# EAGLE design nanoscan (EAGLE 9.6.2)
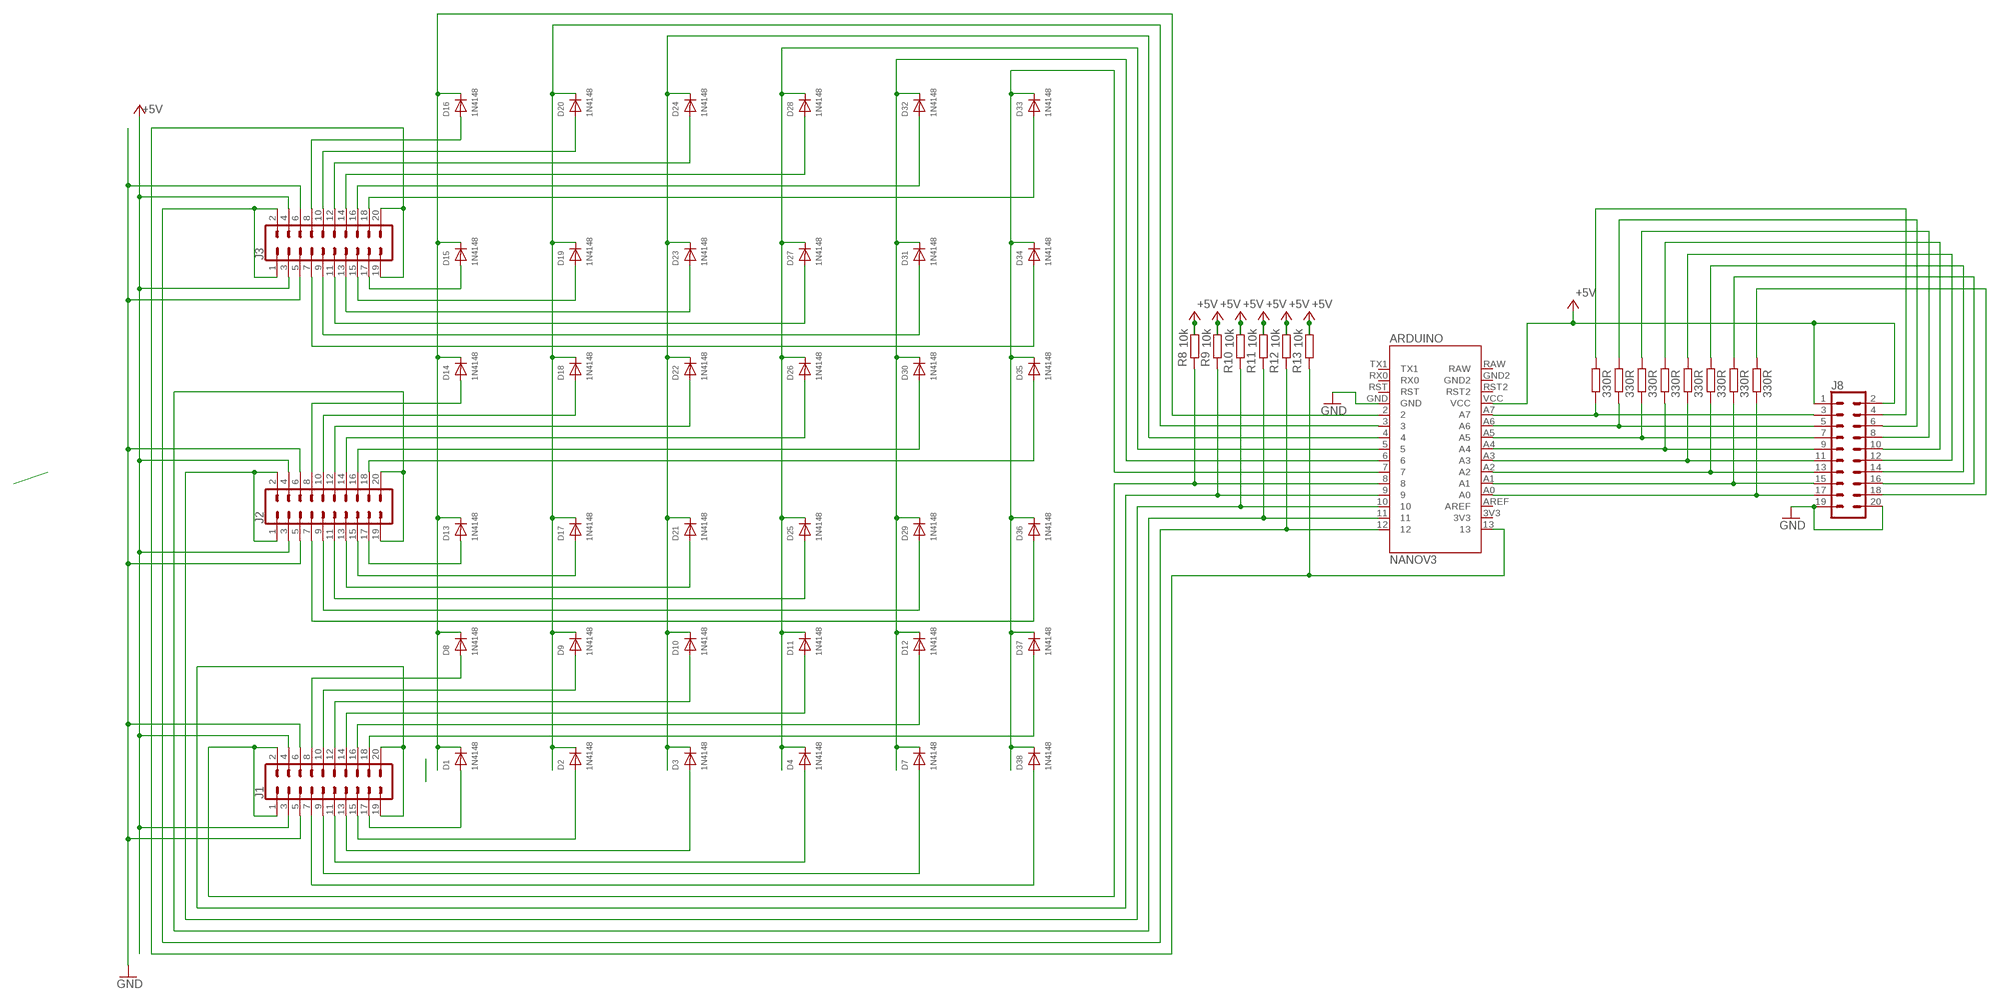
[diagram p0: schematic, sheet 1]

## Parts
ARDUINO  NANOV3  [NANOV3]
D1  1N4148  DIODEDO-1N4148  [DO-1N4148]
D2  1N4148  DIODEDO-1N4148  [DO-1N4148]
D3  1N4148  DIODEDO-1N4148  [DO-1N4148]
D4  1N4148  DIODEDO-1N4148  [DO-1N4148]
D7  1N4148  DIODEDO-1N4148  [DO-1N4148]
D8  1N4148  DIODEDO-1N4148  [DO-1N4148]
D9  1N4148  DIODEDO-1N4148  [DO-1N4148]
D10  1N4148  DIODEDO-1N4148  [DO-1N4148]
D11  1N4148  DIODEDO-1N4148  [DO-1N4148]
D12  1N4148  DIODEDO-1N4148  [DO-1N4148]
D13  1N4148  DIODEDO-1N4148  [DO-1N4148]
D14  1N4148  DIODEDO-1N4148  [DO-1N4148]
D15  1N4148  DIODEDO-1N4148  [DO-1N4148]
D16  1N4148  DIODEDO-1N4148  [DO-1N4148]
D17  1N4148  DIODEDO-1N4148  [DO-1N4148]
D18  1N4148  DIODEDO-1N4148  [DO-1N4148]
D19  1N4148  DIODEDO-1N4148  [DO-1N4148]
D20  1N4148  DIODEDO-1N4148  [DO-1N4148]
D21  1N4148  DIODEDO-1N4148  [DO-1N4148]
D22  1N4148  DIODEDO-1N4148  [DO-1N4148]
D23  1N4148  DIODEDO-1N4148  [DO-1N4148]
D24  1N4148  DIODEDO-1N4148  [DO-1N4148]
D25  1N4148  DIODEDO-1N4148  [DO-1N4148]
D26  1N4148  DIODEDO-1N4148  [DO-1N4148]
D27  1N4148  DIODEDO-1N4148  [DO-1N4148]
D28  1N4148  DIODEDO-1N4148  [DO-1N4148]
D29  1N4148  DIODEDO-1N4148  [DO-1N4148]
D30  1N4148  DIODEDO-1N4148  [DO-1N4148]
D31  1N4148  DIODEDO-1N4148  [DO-1N4148]
D32  1N4148  DIODEDO-1N4148  [DO-1N4148]
D33  1N4148  DIODEDO-1N4148  [DO-1N4148]
D34  1N4148  DIODEDO-1N4148  [DO-1N4148]
D35  1N4148  DIODEDO-1N4148  [DO-1N4148]
D36  1N4148  DIODEDO-1N4148  [DO-1N4148]
D37  1N4148  DIODEDO-1N4148  [DO-1N4148]
D38  1N4148  DIODEDO-1N4148  [DO-1N4148]
J1  CONN_10X2SPECIAL  [2X10_LOCK_SPECIAL]
J2  CONN_10X2SPECIAL  [2X10_LOCK_SPECIAL]
J3  CONN_10X2SPECIAL  [2X10_LOCK_SPECIAL]
J8  CONN_10X2SPECIAL  [2X10_LOCK_SPECIAL]
R0  330R  R-EU_0207/10  [0207/10]
R1  330R  R-EU_0207/10  [0207/10]
R2  330R  R-EU_0207/10  [0207/10]
R3  330R  R-EU_0207/10  [0207/10]
R4  330R  R-EU_0207/10  [0207/10]
R5  330R  R-EU_0207/10  [0207/10]
R6  330R  R-EU_0207/10  [0207/10]
R7  330R  R-EU_0207/10  [0207/10]
R8  10k  R-EU_0207/10  [0207/10]
R9  10k  R-EU_0207/10  [0207/10]
R10  10k  R-EU_0207/10  [0207/10]
R11  10k  R-EU_0207/10  [0207/10]
R12  10k  R-EU_0207/10  [0207/10]
R13  10k  R-EU_0207/10  [0207/10]

## Nets
+5V [PWR]: ARDUINO.VCC J1.3 J1.4 J2.3 J2.4 J3.3 J3.4 J8.1 J8.2 R8.1 R9.1 R10.1 R11.1 R12.1 R13.1
GND [GND]: ARDUINO.GND J1.5 J1.6 J2.5 J2.6 J3.5 J3.6 J8.19 J8.20
N$2: ARDUINO.6 D7.C D12.C D29.C D30.C D31.C D32.C
N$3: ARDUINO.2 D1.C D8.C D13.C D14.C D15.C D16.C
N$5: ARDUINO.5 D4.C D11.C D25.C D26.C D27.C D28.C
N$7: D33.A J3.18
N$8: D32.A J3.16
N$9: D28.A J3.14
N$10: D24.A J3.12
N$11: D20.A J3.10
N$12: D16.A J3.8
N$13: D34.A J3.7
N$14: D31.A J3.9
N$15: D27.A J3.11
N$16: D23.A J3.13
N$17: D19.A J3.15
N$18: D15.A J3.17
N$19: D35.A J2.18
N$20: D30.A J2.16
N$21: D26.A J2.14
N$22: D22.A J2.12
N$23: D18.A J2.10
N$24: D14.A J2.8
N$25: D38.A J1.7
N$26: D7.A J1.9
N$27: D4.A J1.11
N$28: D3.A J1.13
N$29: D2.A J1.15
N$30: D1.A J1.17
N$31: D37.A J1.18
N$32: D12.A J1.16
N$33: D11.A J1.14
N$34: D10.A J1.12
N$35: D9.A J1.10
N$36: D8.A J1.8
N$37: D36.A J2.7
N$38: D29.A J2.9
N$39: D25.A J2.11
N$40: D21.A J2.13
N$41: D17.A J2.15
N$42: D13.A J2.17
N$43: ARDUINO.9 J1.19 J1.20 R9.2
N$44: ARDUINO.12 J3.1 J3.2 R12.2
N$45: ARDUINO.13 J3.19 J3.20 R13.2
N$46: ARDUINO.10 J2.1 J2.2 R10.2
N$47: ARDUINO.8 J1.1 J1.2 R8.2
N$48: ARDUINO.11 J2.19 J2.20 R11.2
N$49: ARDUINO.A7 J8.3 R7.1
N$50: ARDUINO.A6 J8.5 R6.1
N$51: ARDUINO.A5 J8.7 R5.1
N$52: ARDUINO.A4 J8.9 R4.1
N$53: ARDUINO.A3 J8.11 R3.1
N$54: ARDUINO.A2 J8.13 R2.1
N$55: ARDUINO.A1 J8.15 R1.1
N$56: ARDUINO.A0 J8.17 R0.1
N$57: J8.18 R0.2
N$58: J8.16 R1.2
N$59: J8.14 R2.2
N$60: J8.12 R3.2
N$61: J8.10 R4.2
N$62: J8.8 R5.2
N$63: J8.6 R6.2
N$64: J8.4 R7.2
N$65: ARDUINO.3 D2.C D9.C D17.C D18.C D19.C D20.C
N$67: ARDUINO.4 D3.C D10.C D21.C D22.C D23.C D24.C
N$70: ARDUINO.7 D33.C D34.C D35.C D36.C D37.C D38.C
Unconnected: ARDUINO.3V3 ARDUINO.AREF ARDUINO.GND2 ARDUINO.RAW ARDUINO.RST ARDUINO.RST2 ARDUINO.RX0 ARDUINO.TX1

## Library data of the parts
ARDUINO = Arduino Nano by Jazz:NANOV3
D1-D4 D7-D38 = adafruit:DIODE: Diode SMADIODE - SMA Surface Mount Package 20V 1A Schottky Diode Digikey: 641-1014-6-ND DO-1N4148 - Through Hole Small Current Diode SOD-123 20V 1 A (.5mV Vf) Schottky Diode - Digikey: MBRX120TPMSCT-ND SOD-323 10V 570mA (.38mV Vf, 3ns) Schottky Diode - Digikey: ZLLS410CT-ND SOD-523 30V 30mA Schottky Diode (RB751S-40TE61) - Digikey: RB751S-40TE61CT-ND SOT23-R/W - SOT23 Package (R = Solder Paste/Reflow Ovens, W = Hand-Soldering) BAT54Film 40V 300mA - Digikey: 497-7162-1-ND
J1-J3 J8 = SparkFun-Connectors:CONN_10X2: Multi connection point. Often used as Generic Header-pin footprint for 0.1 inch spaced/style header connections On any of the 0.1 inch spaced packages, you can populate with these: Break Away Headers - Straight <https://www.sparkfun.com/products/116> (PRT-00116) Break Away Male Headers - Right Angle <https://www.sparkfun.com/products/553> (PRT-00553) Female Headers <https://www.sparkfun.com/products/115> (PRT-00115) Break Away Headers - Machine Pin <https://www.sparkfun.com/products/117> (PRT-00117) Break Away Female Headers - Swiss Machine Pin <https://www.sparkfun.com/products/743> (PRT-00743) Special note about the "SPECIAL" package: This was SPECIALLY designed to be used with our Graphic LCD Backpack. Be sure you want to use this! It is not only staggered on each line of header holes, but IT IS ALSO offset of the center point of the top and bottom lines by 5 mil. This causes the headers to lock into place on the "standard" footprint on the LCD screen. The extra squares on the tdocu layer are there simply to reference other pins (if you were to actually populate a longer header than ten long - this is what we do with the backpacks).
R0 R1-R13 = resistor:R-EU_: RESISTOR, European symbol

## Net classes
0 default: width 0.508 mm, drill 0.254 mm, clearance 0.254 mm
1 GND: width 1.016 mm, drill 0.508 mm, clearance 0.254 mm to class 0, clearance 0.254 mm
2 PWR: width 1.016 mm, drill 1.016 mm, clearance 0.254 mm to class 0, clearance 0.254 mm to class 1, clearance 0.254 mm

## Board
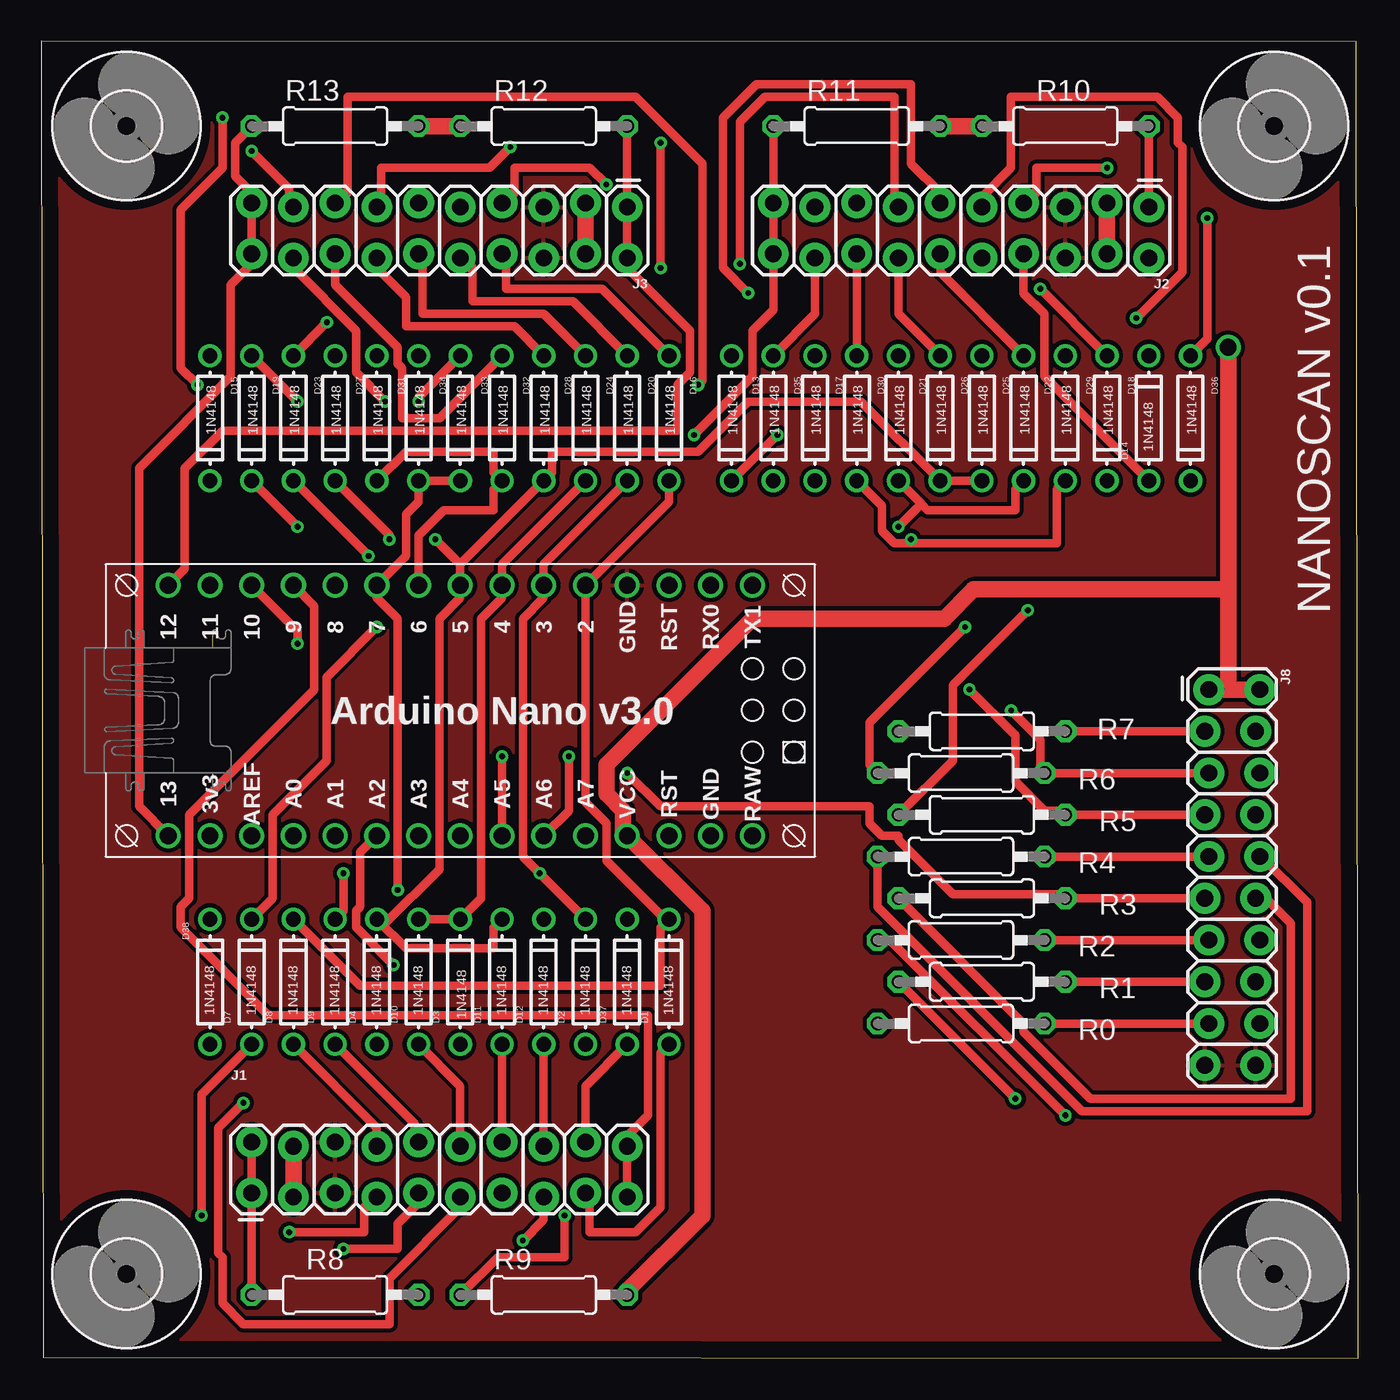
[diagram p1: board, top side]
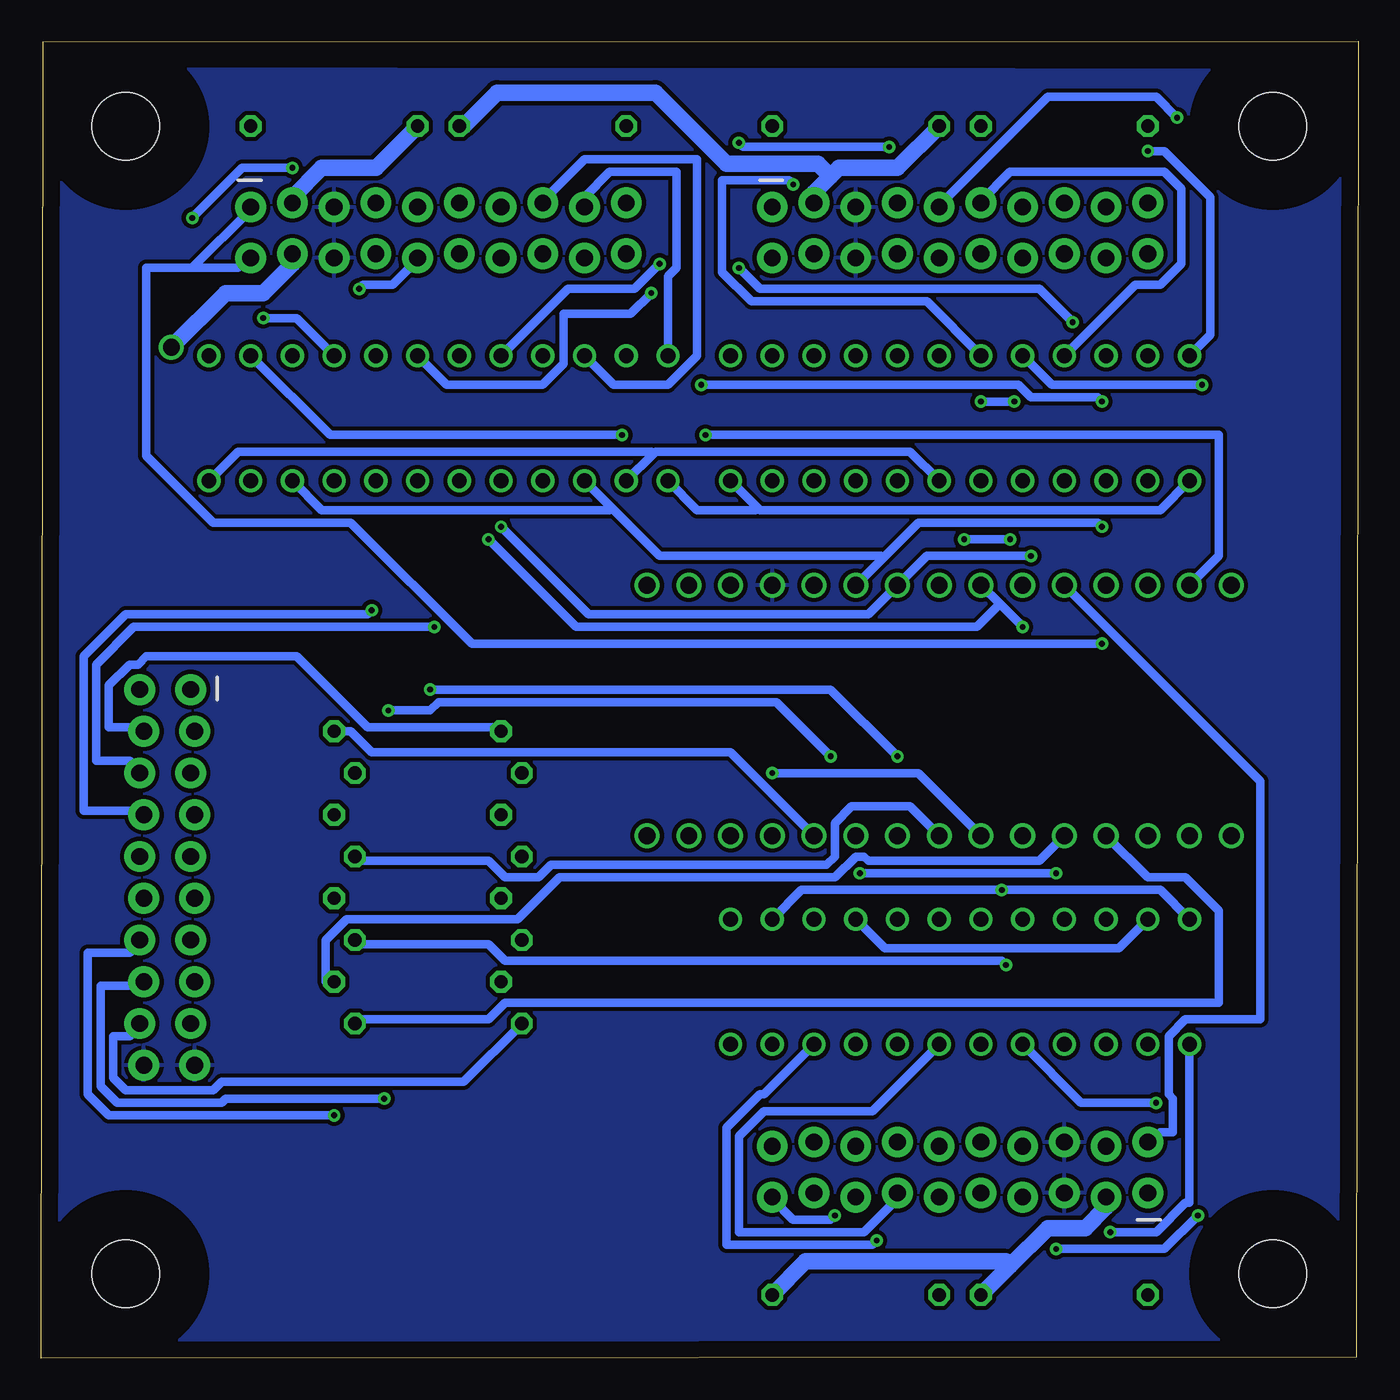
[diagram p2: board, bottom side, seen from below]

Size 80.19 x 80.16 mm. Coordinates in mm from the lower left corner, seen from the top.
Outline: 0.12,0.06 80.19,0 80.07,80.13 0,80.16 0.12,0.06
Copper layers (1+2*15+16): Top 0.035mm / dielectric 1.5mm / Route2 0.035mm / dielectric 0.15mm / Route15 0.035mm / dielectric 0.2mm / Bottom 0.035mm
Design rules "default *": minimum track width 6mil, minimum drill 0.35mm, track to track 6mil, track to pad 6mil, pad to pad 6mil, via to via 6mil, smd to smd 6mil, copper to edge 40mil, drill to drill 6mil, minimum pad ring 10mil, minimum via ring 8mil, stop-mask expansion 4mil, vias tented up to drill 0mil, thermal gap 10mil

### Footprints (pad centres in the part's own frame; a part is rotated, then mirrored left to right if it is on the bottom)
NANOV3 = drill 1.016: 2 -7.62,5.08; 3 -7.62,2.54; 3V3 7.62,-17.78; 4 -7.62,0; 5 -7.62,-2.54; 6 -7.62,-5.08; 7 -7.62,-7.62; 8 -7.62,-10.16; 9 -7.62,-12.7; 10 -7.62,-15.24; 11 -7.62,-17.78; 12 -7.62,-20.32; 13 7.62,-20.32; A0 7.62,-12.7; A1 7.62,-10.16; A2 7.62,-7.62; A3 7.62,-5.08; A4 7.62,-2.54; A5 7.62,0; A6 7.62,2.54; A7 7.62,5.08; AREF 7.62,-15.24; GND -7.62,7.62; GND2 7.62,12.7; RAW 7.62,15.24; RST -7.62,10.16; RST2 7.62,10.16; RX0 -7.62,12.7; TX1 -7.62,15.24; VCC 7.62,7.62
DO-1N4148 = drill 0.9: A -3.81,0; C 3.81,0
2X10_LOCK_SPECIAL = drill 1.016 pad 1.88: 1 0,-0.152; 2 0,2.946; 3 2.54,-0.406; 4 2.54,2.692; 5 5.08,-0.152; 6 5.08,2.946; 7 7.62,-0.406; 8 7.62,2.692; 9 10.16,-0.152; 10 10.16,2.946; 11 12.7,-0.406; 12 12.7,2.692; 13 15.24,-0.152; 14 15.24,2.946; 15 17.78,-0.406; 16 17.78,2.692; 17 20.32,-0.152; 18 20.32,2.946; 19 22.86,-0.406; 20 22.86,2.692
0207/10 = drill 0.813 octagon: 1 -5.08,0; 2 5.08,0
4,1 = hole 4.1: 0,0

### Placement (x,y rotation side)
ARDUINO  28.06,39.43 270 top
D1  38.22,22.92 90 top
D2  33.14,22.92 90 top
D3  25.52,22.92 90 top
D4  20.44,22.92 90 top
D7  12.82,22.92 90 top
D8  15.36,22.92 90 top
D9  17.9,22.92 90 top
D10  22.98,22.92 90 top
D11  28.06,22.92 90 top
D12  30.6,22.92 90 top
D13  42.03,57.21 270 top
D14  67.43,57.21 90 top
D15  10.28,57.21 270 top
D16  38.22,57.21 270 top
D17  47.11,57.21 270 top
D18  64.89,57.21 270 top
D19  12.82,57.21 270 top
D20  35.68,57.21 270 top
D21  52.19,57.21 270 top
D22  59.81,57.21 270 top
D23  15.36,57.21 270 top
D24  33.14,57.21 270 top
D25  57.27,57.21 270 top
D26  54.73,57.21 270 top
D27  17.9,57.21 270 top
D28  30.6,57.21 270 top
D29  62.35,57.21 270 top
D30  49.65,57.21 270 top
D31  20.44,57.21 270 top
D32  28.06,57.21 270 top
D33  25.52,57.21 270 top
D34  22.98,57.21 270 top
D35  44.57,57.21 270 top
D36  69.97,57.21 270 top
D37  35.68,22.92 90 top
D38  10.28,22.92 90 top
J1  12.82,10.22 0 top
J2  67.43,69.91 180 top
J3  35.68,69.91 180 top
J8  71.24,40.7 270 top
R0  56,20.38 180 top
R1  57.27,22.92 180 top
R2  56,25.46 180 top
R3  57.27,28 180 top
R4  56,30.54 180 top
R5  57.27,33.08 180 top
R6  56,35.62 180 top
R7  57.27,38.16 180 top
R8  17.9,3.87 180 top
R9  30.6,3.87 180 top
R10  62.35,74.99 0 top
R11  49.65,74.99 180 top
R12  30.6,74.99 0 top
R13  17.9,74.99 180 top
U$1  [4,1]  75.05,5.14 0 top
U$2  [4,1]  75.05,74.99 0 top
U$3  [4,1]  5.2,74.99 0 top
U$4  [4,1]  5.2,5.14 0 top

### Tracks (layer width: path | path; a pad name or v marks a point on that pad's centre or on a via)
+5V  (via drill 1.02)
  Top 1.016: R9.1 35.68,4.12 40.25,8.7 40.25,27.24 ARDUINO.VCC 35.43,32.06 35.43,33.33 34.41,34.35 34.41,36.13 43.3,45.02 54.98,45.02 56.76,46.8 72.26,46.8 | J1.3 J1.4 | R12.1 R13.1 | J3.3 J3.4 | J8.2 72.26,40.7 | 72.26,40.7 J8.1 | R10.1 R11.1 | J2.3 J2.4 | v72.26,61.53 72.26,46.8 | 72.26,46.8 72.26,40.7
  Bottom 1.016: 21.2,5.65 18.92,7.93 16.63,7.93 15.36,9.2 J1.3 | 21.2,5.65 R8.1 | R9.1 33.65,5.9 21.46,5.9 21.2,5.65 | R12.1 28.06,72.45 31.62,72.45 32.12,71.94 | 32.12,71.94 33.14,70.93 J3.3 | R10.1 59.81,72.45 63.11,72.45 64.89,70.67 J2.3 | v72.26,61.53 68.95,64.83 66.67,64.83 64.89,66.61 J2.4 | 32.12,71.94 32.89,72.7 38.47,72.7 42.79,77.02 52.44,77.02 54.48,74.99 R11.1
GND
  pour Bottom: -16.73,78.42 133.78,78.54 133.78,-39.72 -15.98,-39.72 -16.39,-39.31
  pour Top: -21.47,-13.91 -21.47,90.23 125.85,90.23 125.85,-13.91
N$2  (via drill 0.35)
  Top 0.508: D30.C 51.17,51.88 51.17,50.35 51.94,49.59 52.95,49.59 | 52.95,49.59 61.84,49.59 61.84,52.89 D29.C | D31.C 22.22,55.18 27.55,55.18 27.55,53.91 D32.C 27.81,53.4 27.81,53.15 27.55,52.89 27.55,51.62 24.5,51.62 22.98,50.1 ARDUINO.6 | v20.44,44.51 17.39,41.46 17.39,36.38 14.09,33.08 14.09,28 D7.C | v52.95,49.84 52.95,49.59
  Bottom 0.508: D7.C 14.6,24.95 28.82,24.95 D12.C | v20.44,44.51 21.84,45.91 | 21.84,45.91 ARDUINO.6 | v52.95,49.84 47.62,44.51 23.23,44.51 21.84,45.91
N$3  (via drill 0.35)
  Top 0.508: D8.C 19.42,22.67 37.71,22.67 37.71,26.22 D1.C 37.97,26.73 34.41,30.29 34.41,32.57 33.14,33.84 ARDUINO.2 38.22,52.13 D16.C | D13.C v44.82,56.19
  Bottom 0.508: D15.C 12.06,51.62 36.44,51.62 36.57,51.75 | D16.C 36.57,51.75 | D13.C 40.25,51.62 36.7,51.62 36.57,51.75 | D14.C 62.6,56.19 v44.82,56.19
N$5  (via drill 0.35)
  Top 0.508: D11.C 27.55,26.22 27.55,24.95 22.22,24.95 D4.C 20.95,26.48 24.25,29.78 24.25,45.02 25.52,46.29 ARDUINO.5 25.52,48.32 | D25.C D26.C 49.9,58.23 43.05,58.23 40,55.18 31.11,55.18 31.11,53.91 D28.C 25.52,48.32 | D27.C 21.2,50.1 v21.2,49.84 | 25.52,48.32 v24,49.84
  Bottom 0.508: v24,49.84 v21.2,49.84
N$7  (via drill 0.35)
  Top 0.508: D33.A 22.98,58.48 v22.98,58.23 | v20.95,58.23 19.17,60 19.17,62.54 15.36,66.35 J3.18
  Bottom 0.508: v20.95,58.23 v22.98,58.23
N$8
  Top 0.508: D32.A 24.25,57.21 21.96,57.21 21.96,60.26 21.71,60.51 21.71,61.53 17.9,65.34 J3.16
N$9
  Top 0.508: D28.A 28.82,62.8 22.22,62.8 22.22,64.58 20.44,66.35 J3.14
N$10
  Top 0.508: D24.A 30.6,63.56 23.23,63.56 23.23,66.86 22.98,67.12 J3.12
N$11
  Top 0.508: D20.A 32.38,64.32 26.28,64.32 26.28,66.35 25.52,67.12 J3.10
N$12
  Top 0.508: D16.A 34.16,65.08 28.31,65.08 28.31,66.86 28.06,67.12 J3.8
N$13  (via drill 0.35)
  Top 0.508: v34.41,71.43 33.39,72.45 28.82,72.45 28.82,70.93 28.06,70.16 J3.7
  Bottom 0.508: D34.A 26.28,64.32 36.95,64.32 38.73,66.1 38.73,71.69 34.66,71.69 v34.41,71.43
N$14  (via drill 0.35)
  Top 0.508: v9.52,59.24 8.5,60.26 8.5,69.91 11.04,72.45 v11.04,75.5
  Bottom 0.508: D31.A 18.66,59.24 v9.52,59.24 | v11.04,75.5 12.31,76.77 18.92,76.77 25.52,70.16 J3.9
N$15
  Bottom 0.508: D27.A 13.58,65.34 12.06,65.34 10.79,66.61 10.79,71.18 11.8,72.2 21.2,72.2 22.98,70.42 J3.11
N$16  (via drill 0.35)
  Top 0.508: v17.39,63.05 D23.A | v37.71,73.97 v37.71,66.35 | v28.57,73.72 27.3,72.45 20.69,72.45 20.69,70.42 20.44,70.16 J3.13
  Bottom 0.508: v17.39,63.05 19.42,65.08 36.44,65.08 v37.71,66.35 | v37.71,73.97 37.46,73.72 v28.57,73.72
N$17  (via drill 0.35)
  Top 0.508: v15.61,58.23 D19.A | v40,59.24 40.25,59.5 40.25,72.7 36.19,76.77 18.66,76.77 18.66,70.93 17.9,70.16 J3.15
  Bottom 0.508: v15.61,58.23 15.87,58.48 19.93,58.48 20.69,59.24 v40,59.24
N$18  (via drill 0.35)
  Top 0.508: v12.82,73.47 15.11,71.18 15.11,70.42 15.36,70.16 J3.17
  Bottom 0.508: D15.A 9.01,62.29 9.01,70.67 11.8,73.47 v12.82,73.47
N$19
  Top 0.508: D35.A 47.11,63.56 J2.18
N$20
  Top 0.508: J2.16 D30.A
N$21
  Top 0.508: D26.A 52.19,63.56 J2.14
N$22
  Top 0.508: D22.A 54.73,66.1 J2.12
N$23  (via drill 0.35)
  Top 0.508: v60.83,65.08 D18.A
  Bottom 0.508: v60.83,65.08 60.57,65.34 58.79,65.34 57.27,66.86 J2.10
N$24
  Top 0.508: D14.A 61.08,59.75 61.08,63.56 59.81,64.83 J2.8
N$25  (via drill 0.35)
  Top 0.508: v15.11,7.68 19.68,7.68 19.68,9.2 20.44,9.97 J1.7
  Bottom 0.508: D38.A 10.28,9.46 10.53,9.46 12.31,7.68 v15.11,7.68
N$26  (via drill 0.35)
  Top 0.508: D7.A 9.77,16.06 v9.77,8.7 | v18.41,6.66 21.71,6.66 21.71,8.19 22.98,9.46 J1.9
  Bottom 0.508: v9.77,8.7 11.8,6.66 v18.41,6.66
N$27  (via drill 0.35)
  Top 0.508: v12.31,15.55 10.79,14.03 10.79,6.41 11.04,6.16 11.04,3.36 12.31,2.09 21.2,2.09 21.2,4.89 25.52,9.2 J1.11
  Bottom 0.508: D4.A 16.88,15.55 v12.31,15.55
N$28
  Bottom 0.508: D3.A 29.58,15.05 36.19,15.05 37.71,13.52 37.71,7.68 30.09,7.68 28.06,9.71 J1.13
N$29  (via drill 0.35)
  Top 0.508: v29.33,7.17 30.6,8.44 J1.15
  Bottom 0.508: D2.A 36.19,16.06 36.44,16.06 38.47,14.03 38.47,6.92 29.58,6.92 v29.33,7.17
N$30
  Top 0.508: D1.A 37.71,18.6 37.71,9.2 36.19,7.68 33.39,7.68 33.39,9.71 33.14,9.97 J1.17
N$31
  Top 0.508: D37.A 33.14,16.57 J1.18
N$32
  Top 0.508: J1.16 D12.A
N$33
  Top 0.508: J1.14 D11.A
N$34
  Top 0.508: D10.A 25.52,16.57 J1.12
N$35
  Top 0.508: D9.A 22.73,14.28 22.73,13.52 22.98,13.27 J1.10
N$36
  Top 0.508: D8.A 20.44,14.03 J1.8
N$37  (via drill 0.35)
  Top 0.508: D36.A 70.99,62.04 v70.99,69.4 | v64.89,72.45 60.57,72.45 60.57,70.93 59.81,70.16 J2.7
  Bottom 0.508: v70.99,69.4 67.94,72.45 v64.89,72.45
N$38  (via drill 0.35)
  Top 0.508: v66.67,63.31 69.46,66.1 69.46,73.72 69.21,73.97 69.21,75.5 67.94,76.77 59.05,76.77 59.05,72.45 57.27,70.67 J2.9
  Bottom 0.508: D29.A 64.64,63.31 v66.67,63.31
N$39  (via drill 0.35)
  Top 0.508: v43.05,64.83 41.52,66.35 41.52,75.5 43.55,77.53 52.95,77.53 52.95,72.7 54.73,70.93 J2.11
  Bottom 0.508: D25.A 55.49,59.24 49.65,59.24 48.38,60.51 48.38,63.56 44.32,63.56 v43.05,64.83
N$40  (via drill 0.35)
  Top 0.508: v42.54,66.61 42.54,75.24 44.06,76.77 51.94,76.77 51.94,70.42 52.19,70.16 J2.13
  Bottom 0.508: D21.A 48.13,65.08 44.06,65.08 v42.54,66.61
N$41
  Bottom 0.508: D17.A 45.33,59.24 42.03,59.24 40.25,61.02 40.25,72.96 47.11,72.96 49.65,70.42 J2.15
N$42
  Bottom 0.508: D13.A 42.03,65.85 41.52,66.35 41.52,72.2 45.59,72.2 47.11,70.67 J2.17
N$43  (via drill 0.35)
  Top 0.508: R9.2 27.81,6.16 31.87,6.16 v31.87,8.7 | ARDUINO.9 16.63,45.78 16.63,40.7 9.01,33.08 9.01,28 8.5,27.49 8.5,26.22 13.84,20.89 36.95,20.89 36.95,14.79 35.68,13.52 J1.20 J1.19
  Bottom 0.508: v31.87,8.7 32.12,8.44 34.41,8.44 35.68,9.71 J1.19
N$44
  Top 0.508: R12.2 J3.1 J3.2 35.68,66.35 39.49,62.54 39.49,60 38.73,59.24 38.73,56.45 11.04,56.45 8.76,54.16 8.76,48.07 ARDUINO.12
N$45
  Top 0.508: R13.2 11.8,73.97 11.8,71.94 12.82,70.93 J3.19 J3.20 12.82,66.61 11.55,65.34 11.55,59.75 5.96,54.16 5.96,33.59 ARDUINO.13
N$46  (via drill 0.35)
  Top 0.508: J2.1 R10.2 | ARDUINO.10 15.61,44.26 v15.61,43.49
  Bottom 0.508: v15.61,43.49 53.97,43.49 61.33,50.86 69.72,50.86 73.78,54.92 73.78,66.35 70.99,66.35 | 70.99,66.35 68.19,66.35 67.68,66.86 67.43,66.86 J2.2 | 70.99,66.35 67.43,69.91 J2.1
N$47
  Top 0.508: R8.2 J1.1 J1.2
  Bottom 0.508: ARDUINO.8 5.96,35.11 5.96,20.63 10.53,20.63 11.55,19.62 11.55,16.06 11.3,15.81 11.3,13.78 12.06,13.78 12.57,13.27 12.82,13.27 J1.2
N$48  (via drill 0.35)
  Top 0.508: R11.2 J2.19 J2.20 44.57,63.81 43.3,62.54 43.3,59.75 v39.74,56.19
  Bottom 0.508: ARDUINO.11 8.5,48.83 8.5,56.19 v39.74,56.19
N$49
  Top 0.508: J8.3 R7.1
  Bottom 0.508: ARDUINO.A7 38.22,36.89 60.06,36.89 61.33,38.16 R7.1
N$50  (via drill 0.35)
  Top 0.508: J8.5 R6.1 60.83,35.87 60.83,37.65 v59.05,39.43 | ARDUINO.A6 32.12,33.33 v32.12,36.64
  Bottom 0.508: v32.12,36.64 35.43,39.94 56,39.94 56.51,39.43 v59.05,39.43
N$51  (via drill 0.35)
  Top 0.508: J8.7 R5.1 62.35,33.33 61.08,33.33 59.3,35.11 59.3,37.91 v56.51,40.7 | v28.06,36.64 ARDUINO.A5
  Bottom 0.508: v28.06,36.64 32.12,40.7 v56.51,40.7
N$52
  Top 0.508: J8.9 R4.1
  Bottom 0.508: ARDUINO.A4 27.3,33.59 30.85,33.59 31.87,32.57 31.87,30.54 32.38,30.03 49.14,30.03 49.9,29.27 51.94,29.27 52.95,30.29 60.83,30.29 R4.1
N$53  (via drill 0.35)
  Top 0.508: J8.11 R3.1 62.35,28.25 55.49,28.25 52.19,31.56 52.19,31.81 51.17,31.81 50.41,32.57 50.41,33.59 37.71,33.59 v35.68,35.62
  Bottom 0.508: ARDUINO.A3 26.79,35.62 v35.68,35.62
N$54  (via drill 0.35)
  Top 0.508: J8.13 R2.1 | ARDUINO.A2 19.42,30.79 19.42,27.49 19.17,27.24 19.17,26.22 v21.46,23.94
  Bottom 0.508: v21.46,23.94 21.71,24.19 51.94,24.19 52.95,25.21 60.83,25.21 R2.1
N$55
  Top 0.508: J8.15 R1.1
  Bottom 0.508: ARDUINO.A1 19.42,30.29 29.84,30.29 30.09,30.54 30.6,30.54 31.87,29.27 48.63,29.27 51.17,26.73 61.59,26.73 62.86,25.46 62.86,22.92 R1.1
N$56
  Top 0.508: J8.17 R0.1
  Bottom 0.508: ARDUINO.A0 12.82,29.27 10.53,29.27 8.5,27.24 8.5,21.65 51.94,21.65 52.95,20.63 60.83,20.63 R0.1
N$57
  Bottom 0.508: R0.2 54.48,16.82 69.21,16.82 69.72,16.32 75.05,16.32 75.81,17.08 75.81,19.62 74.8,19.62 74.03,20.38 J8.18
N$58  (via drill 0.35)
  Top 0.508: v59.3,15.81 R1.2
  Bottom 0.508: v59.3,15.81 68.95,15.81 69.21,15.55 75.56,15.55 76.57,16.57 76.57,22.67 74.29,22.67 74.03,22.92 J8.16
N$59  (via drill 0.35)
  Top 0.508: R2.2 51.68,25.46 v62.35,14.79
  Bottom 0.508: v62.35,14.79 76.07,14.79 77.34,16.06 77.34,24.7 74.8,24.7 74.03,25.46 J8.14
N$60
  Top 0.508: R3.2 59.81,20.38 59.81,19.87 63.87,15.81 76.07,15.81 76.07,26.48 74.54,28 J8.12
N$61
  Top 0.508: R4.2 50.92,27.49 63.37,15.05 77.08,15.05 77.08,27.75 74.29,30.54 J8.10
N$62  (via drill 0.35)
  Top 0.508: R5.2 55.49,36.38 55.49,40.95 v60.06,45.53
  Bottom 0.508: v60.06,45.53 60.32,45.27 75.05,45.27 77.59,42.73 77.59,33.33 74.29,33.33 74.03,33.08 J8.8
N$63  (via drill 0.35)
  Top 0.508: R6.2 50.41,36.13 50.41,38.67 v56.25,44.51
  Bottom 0.508: v56.25,44.51 74.54,44.51 76.83,42.22 76.83,36.38 74.8,36.38 74.03,35.62 J8.6
N$64
  Bottom 0.508: R7.2 52.44,38.41 60.32,38.41 64.64,42.73 73.78,42.73 74.29,42.22 74.8,42.22 76.07,40.95 76.07,38.41 74.29,38.41 74.03,38.16 J8.4
N$65  (via drill 0.35)
  Top 0.508: D9.C 18.41,27.24 v18.41,29.52 | D2.C v30.35,29.52 29.33,30.54 29.33,45.02 30.6,46.29 ARDUINO.3 30.6,48.32 D20.C | v15.61,50.61 D19.C
  Bottom 0.508: v30.35,29.52 v18.41,29.52 | v15.61,50.61 15.87,50.86 26.79,50.86 28.95,48.7 | ARDUINO.3 28.95,48.7 | 45.46,51.75 42.54,48.83 29.08,48.83 28.95,48.7 | 45.46,51.75 D17.C | D18.C 63.11,51.62 45.59,51.62 45.46,51.75
N$67  (via drill 0.35)
  Top 0.508: 53.59,52 53.97,51.62 59.3,51.62 59.3,52.89 D22.C | 53.59,52 D21.C | D10.C D3.C 26.79,28 26.79,45.02 28.06,46.29 ARDUINO.4 28.06,48.32 D24.C | v19.93,48.83 D23.C | v52.19,50.61 53.59,52
  Bottom 0.508: v19.93,48.83 26.28,48.83 ARDUINO.4 29.84,45.27 46.86,45.27 v52.19,50.61
N$70  (via drill 0.35)
  Top 0.508: D33.C D34.C 22.98,52.13 22.22,51.37 22.22,48.83 ARDUINO.7 20.44,46.29 21.71,45.02 v21.71,28.51
  Bottom 0.508: D38.C 12.06,28.51 v21.71,28.51 33.9,28.51 D37.C | 42.92,55.05 42.79,55.18 27.3,55.18 D33.C | 42.92,55.05 D35.C | D36.C 68.19,55.18 43.05,55.18 42.92,55.05

### Text on the board
tNames: NANOSCAN v0.1
bValues: www.github.com/ajvdw